# Altium project D1_projet_traveling_app4.PrjPCB
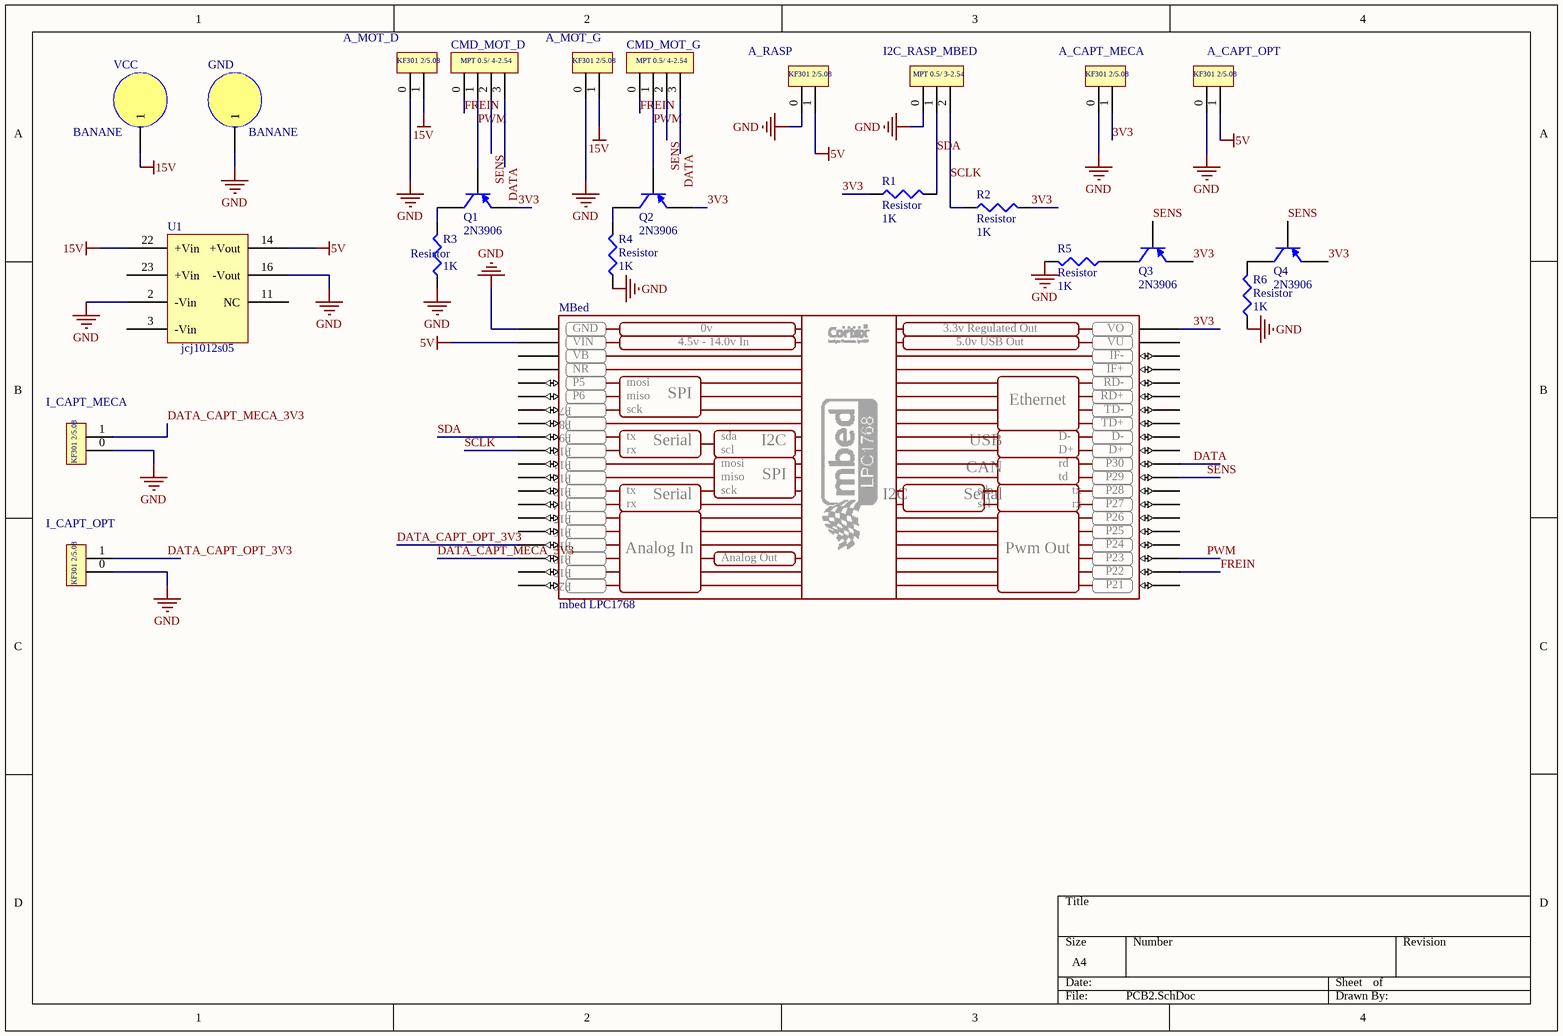
[diagram p0: PCB2.SchDoc]
1 sheet, 24 parts. Net scope: global (net labels, ports and power ports of the same name join across sheets).
Board file: PCB2.PcbDoc

## Sheet PCB2.SchDoc
size A4

### Parts
A_CAPT_MECA  Screw Terminal 2/5.08  [KF301_2/5.08]  (value not drawn)
A_CAPT_OPT  Screw Terminal 2/5.08  [KF301_2/5.08]  (value not drawn)
A_MOT_D  Screw Terminal 2/5.08  [KF301_2/5.08]  (value not drawn)
A_MOT_G  Screw Terminal 2/5.08  [KF301_2/5.08]  (value not drawn)
A_RASP  Screw Terminal 2/5.08  [KF301_2/5.08]  (value not drawn)
CMD_MOT_D  Screw Terminal 4/2.54  [MPT_0.5-4-2.54]  (value not drawn)
CMD_MOT_G  Screw Terminal 4/2.54  [MPT_0.5-4-2.54]  (value not drawn)
GND  BANANE  [connecteur_banane_v0.1]
I2C_RASP_MBED  Screw Terminal 3/2.54  [MPT_0.5-3-2.54]  (value not drawn)
I_CAPT_MECA  Screw Terminal 2/5.08  [KF301_2/5.08]  (value not drawn)
I_CAPT_OPT  Screw Terminal 2/5.08  [KF301_2/5.08]  (value not drawn)
MBed  mbed LPC1768  [DIP40-LARGE]
Q1  2N3906  [TO-92A]
Q2  2N3906  [TO-92A]
Q3  2N3906  [TO-92A]
Q4  2N3906  [TO-92A]
R1  Resistor  value 1K  [AXIAL-0.6]
R2  Resistor  value 1K  [AXIAL-0.6]
R3  Resistor  value 1K  [AXIAL-0.6]
R4  Resistor  value 1K  [AXIAL-0.6]
R5  Resistor  value 1K  [AXIAL-0.6]
R6  Resistor  value 1K  [AXIAL-0.6]
U1  jcj1012s05  [jcj1012s05]
VCC  BANANE  [connecteur_banane_v0.1]

### Nets
5V: A_CAPT_OPT.1 A_RASP.1 MBed.2(VIN) U1.14(+Vout)
15V: A_MOT_D.1 A_MOT_G.1 U1.22(+Vin) VCC.1
GND: A_CAPT_MECA.0 A_CAPT_OPT.0 A_MOT_D.0 A_MOT_G.0 A_RASP.0 GND.1 I2C_RASP_MBED.0 I_CAPT_MECA.0 I_CAPT_OPT.0 MBed.1(GND) R3.1 R4.1 R5.2 R6.1 U1.2(-Vin) U1.16(-Vout)
3V3: A_CAPT_MECA.1 MBed.40(VO) Q1.1(E) Q2.1(E) Q3.1(E) Q4.1(E) R1.1 R2.2
DATA: CMD_MOT_D.3 CMD_MOT_G.3 MBed.30(P30)
DATA_CAPT_MECA_3V3: I_CAPT_MECA.1 MBed.18(P18)
DATA_CAPT_OPT_3V3: I_CAPT_OPT.1 MBed.17(P17)
FREIN: CMD_MOT_D.0 CMD_MOT_G.0 MBed.22(P22)
PWM: CMD_MOT_D.1 CMD_MOT_G.1 MBed.23(P23) Q1.2(B) Q2.2(B)
SCLK: I2C_RASP_MBED.2 MBed.10(P10) R2.1
SDA: I2C_RASP_MBED.1 MBed.9(P9) R1.2
SENS: CMD_MOT_D.2 CMD_MOT_G.2 MBed.29(P29) Q3.2(B) Q4.2(B)
NetQ1_3: Q1.3(C) R3.2
NetQ2_3: Q2.3(C) R4.2
NetQ3_3: Q3.3(C) R5.1
NetQ4_3: Q4.3(C) R6.2

Not connected (* = marked no-connect by the designer): MBed 3(VB) 4(NR) 5(P5) 6(P6) 7(P7) 8(P8) 11(P11) 12(P12) 13(P13) 14(P14) 15(P15) 16(P16) 19(P19) 20(P20) 21(P21) 24(P24) 25(P25) 26(P26) 27(P27) 28(P28) 31(D+) 32(D-) 33(TD+) 34(TD-) 35(RD+) 36(RD-) 37(IF+) 38(IF-) 39(VU); U1 3(-Vin) 11(NC) 23(+Vin)

### Notes on the sheet
- (in symbol mbed LPC1768) 0v; 3.3v Regulated Out; 4.5v - 14.0v In; 5.0v USB Out; mosi; miso; SPI; Ethernet; sck; tx; sda; Serial; I2C; USB; rx; scl; rd; CAN; td; Analog In; Pwm Out; Analog Out
- (in symbol Screw Terminal 2/5.08) KF301 2/5.08
- (in symbol Screw Terminal 3/2.54) MPT 0.5/ 3-2.54
- (in symbol Screw Terminal 4/2.54) MPT 0.5/ 4-2.54

### Library data of the parts
A_CAPT_MECA A_CAPT_OPT A_MOT_D A_MOT_G A_RASP I_CAPT_MECA I_CAPT_OPT = Screw Terminal 2/5.08: KF301 2 contacts / 5.08mm; Supplier 1: Farnell; Supplier Part Number 1: 3041529
CMD_MOT_D CMD_MOT_G = Screw Terminal 4/2.54: MPT 0.5/ 4 contacts / 2.54mm; Supplier 1: Farnell; Supplier Part Number 1: 3041414
GND VCC = Socket 4 mm: socket 4 mm with nut; Supplier 1: Farnell; Supplier Part Number 1: 1176428
I2C_RASP_MBED = Screw Terminal 3/2.54: MPT 0.5/ 3 contacts / 2.54mm; Supplier 1: Farnell; Supplier Part Number 1: 3041360
MBed = mbed LPC1768: Prototyping Board; Supplier 1: Farnell; Supplier 2: RS-Components; Supplier Part Number 1: 1761179; Supplier Part Number 2: 769-4182
Q1-Q4 = 2N3906: PNP General Purpose Amplifier; Published: 8-Jun-2000; LatestRevisionDate: 15-Jan-2003; LatestRevisionNote: PCB Footprint 'BCY-W3/D4.7' replaced; DatasheetVersion: 1997; PackageVersion: Sep-1998; PackageReference: TO-92A; Publisher: Altium Limited; PackageDescription: TO, Flat Index; 3 In-Line, Axial Leads; Body Dia. 4.5mm; Leads 0.51 x 0.48 mm (max); ComponentLink1Description: Manufacturer Link; ComponentLink1URL: http://www.fairchildsemi.com/; ComponentLink2Description: Datasheet; ComponentLink2URL: http://www.fairchildsemi.com/ds/2N%2F2N3906.pdf
R1-R6 = Resistor: Published: 8-Jun-2000; LatestRevisionDate: 29-May-2009; LatestRevisionNote: IPC-7351 Footprint Added.; PackageReference: J1-0603; Publisher: Altium Limited; PackageDescription: Chip Resistor